# Altium schematic sheet 05_Ethernet_Interface.SchDoc
size A4; SheetNumber: 4; SheetTotal: 7
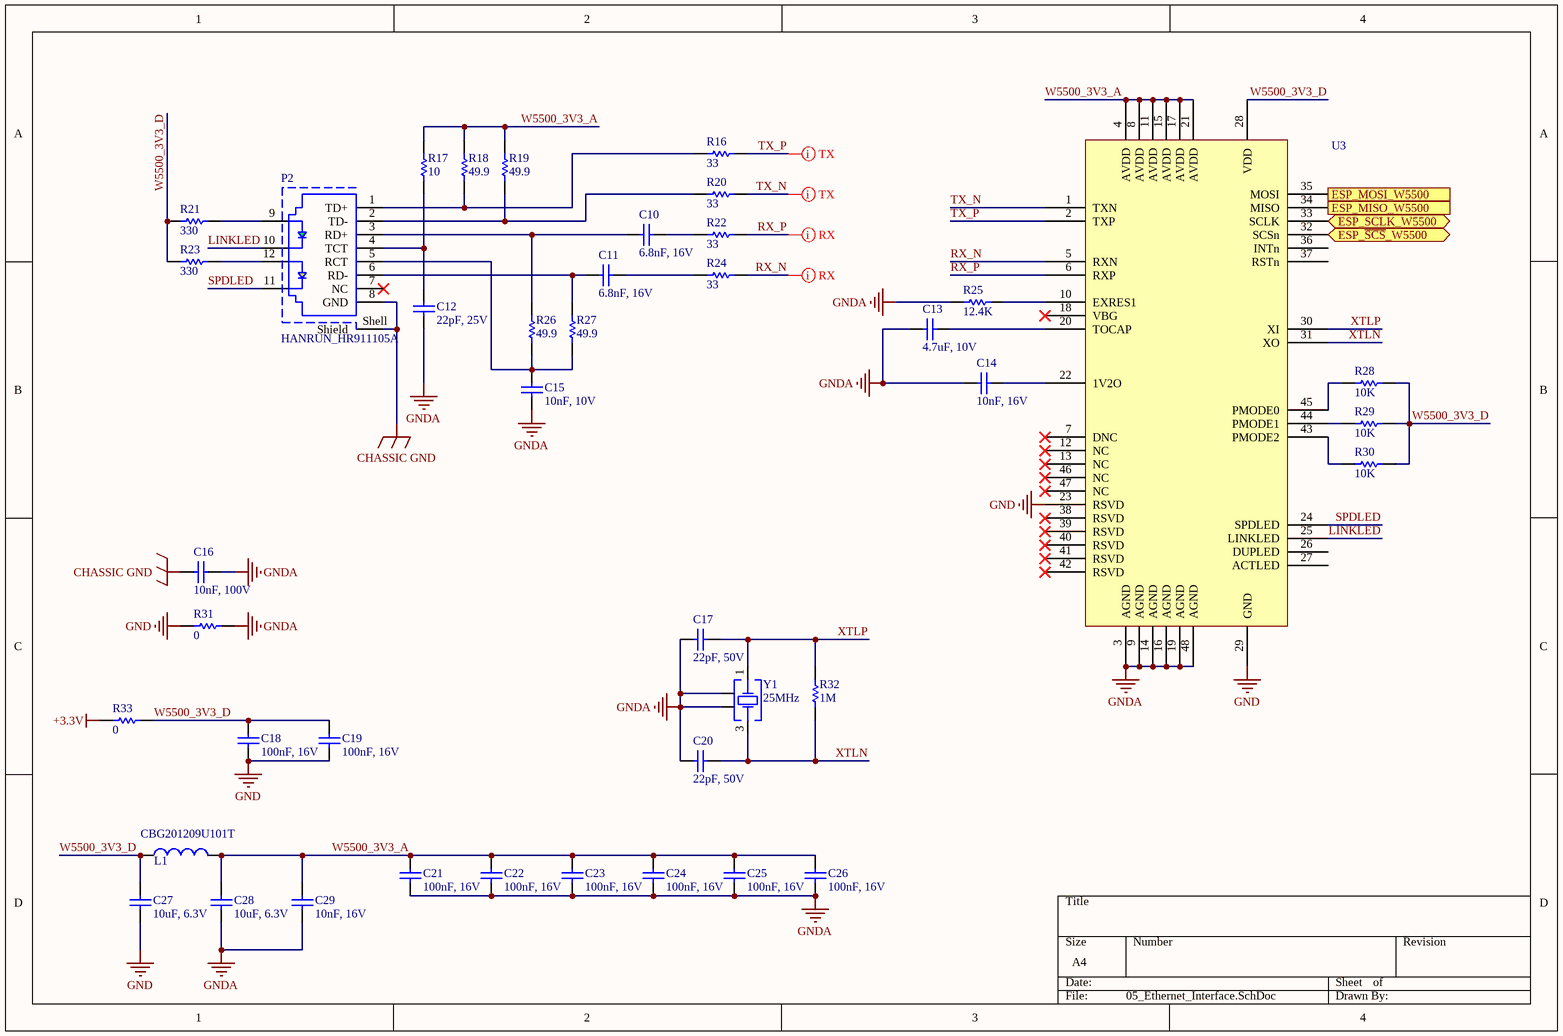
[diagram p0: 05_Ethernet_Interface.SchDoc]

## Parts
C10  6.8nF, 16V  [WCAP-CSGP_0603_H=0.8mm_Reflow]
C11  6.8nF, 16V  [WCAP-CSGP_0603_H=0.8mm_Reflow]
C12  22pF, 25V  [WCAP-CSGP_0603_H=0.8mm_Reflow]
C13  4.7uF, 10V  [WCAP-CSGP_0603_H=0.8mm_Reflow]
C14  10nF, 16V  [WCAP-CSGP_0603_H=0.8mm_Reflow]
C15  10nF, 10V  [WCAP-CSGP_0603_H=0.8mm_Reflow]
C16  10nF, 100V  [WCAP-CSGP_0603_H=0.8mm_Reflow]
C17  22pF, 50V  [WCAP-CSGP_0603_H=0.8mm_Reflow]
C18  100nF, 16V  [WCAP-CSGP_0603_H=0.8mm_Reflow]
C19  100nF, 16V  [WCAP-CSGP_0603_H=0.8mm_Reflow]
C20  22pF, 50V  [WCAP-CSGP_0603_H=0.8mm_Reflow]
C21  100nF, 16V  [WCAP-CSGP_0603_H=0.8mm_Reflow]
C22  100nF, 16V  [WCAP-CSGP_0603_H=0.8mm_Reflow]
C23  100nF, 16V  [WCAP-CSGP_0603_H=0.8mm_Reflow]
C24  100nF, 16V  [WCAP-CSGP_0603_H=0.8mm_Reflow]
C25  100nF, 16V  [WCAP-CSGP_0603_H=0.8mm_Reflow]
C26  100nF, 16V  [WCAP-CSGP_0603_H=0.8mm_Reflow]
C27  10uF, 6.3V  [WCAP-CSGP_0603_H=0.8mm_Reflow]
C28  10uF, 6.3V  [WCAP-CSGP_0603_H=0.8mm_Reflow]
C29  10nF, 16V  [WCAP-CSGP_0603_H=0.8mm_Reflow]
L1  CBG201209U101T  [I0805]
P2  HANRUN_HR911105A  [HANRUN_HR911105A]
R16  value 33  [R0603]  (hidden comment: Resistor)
R17  value 10  [R0603]  (hidden comment: Resistor)
R18  value 49.9  [R0603]  (hidden comment: Resistor)
R19  value 49.9  [R0603]  (hidden comment: Resistor)
R20  value 33  [R0603]  (hidden comment: Resistor)
R21  value 330  [R0603]  (hidden comment: Resistor)
R22  value 33  [R0603]  (hidden comment: Resistor)
R23  value 330  [R0603]  (hidden comment: Resistor)
R24  value 33  [R0603]  (hidden comment: Resistor)
R25  value 12.4K  [R0603]  (hidden comment: Resistor)
R26  value 49.9  [R0603]  (hidden comment: Resistor)
R27  value 49.9  [R0603]  (hidden comment: Resistor)
R28  value 10K  [R0603]  (hidden comment: Resistor)
R29  value 10K  [R0603]  (hidden comment: Resistor)
R30  value 10K  [R0603]  (hidden comment: Resistor)
R31  value 0  [R0603]  (hidden comment: Resistor)
R32  value 1M  [R0603]  (hidden comment: Resistor)
R33  value 0  [R0805]  (hidden comment: Resistor)
U3  W5500  [TSQFP50P900X900X160-48N]  (value not drawn)
Y1  25MHz  [WE-XTAL_CFPX-180]

## Ports
ESP_MISO_W5500 (out), ESP_MOSI_W5500 (in), ESP_SCLK_W5500 (bidir), ESP_~{SCS}_W5500 (bidir)

## Nets
+3.3V: R33.2
CHASSIC GND: C16.1 P2.8(GND) P2.Shell(Shield)
GND: C18.1 C19.1 C27.1 R31.2 U3.23(RSVD) U3.29(GND)
GNDA: C12.1 C13.1 C14.2 C15.1 C16.2 C17.1 C20.1 C21.1 C22.1 C23.1 C24.1 C25.1 C26.1 C28.1 C29.1 R25.2 R31.1 U3.3(AGND) U3.9(AGND) U3.14(AGND) U3.16(AGND) U3.19(AGND) U3.48(AGND) Y1.2(GND&Lid) Y1.4(GND&Lid)
ESP_MISO_W5500: U3.34(MISO) ; port ESP_MISO_W5500
ESP_MOSI_W5500: U3.35(MOSI) ; port ESP_MOSI_W5500
ESP_~{SCS}_W5500: U3.32(SCSn) ; port ESP_~{SCS}_W5500
ESP_SCLK_W5500: U3.33(SCLK) ; port ESP_SCLK_W5500
LINKLED: P2.10 U3.25(LINKLED)
RX_N: R24.1 U3.5(RXN)
RX_P: R22.1 U3.6(RXP)
SPDLED: P2.11 U3.24(SPDLED)
TX_N: R20.1 U3.1(TXN)
TX_P: R16.1 U3.2(TXP)
W5500_3V3_A: C21.2 C22.2 C23.2 C24.2 C25.2 C26.2 C28.2 C29.2 L1.2 R17.2 R18.2 R19.2 U3.4(AVDD) U3.8(AVDD) U3.11(AVDD) U3.15(AVDD) U3.17(AVDD) U3.21(AVDD)
W5500_3V3_D: C18.2 C19.2 C27.2 L1.1 R21.2 R23.2 R28.2 R29.2 R30.2 R33.1 U3.28(VDD)
XTLN: C20.2 R32.1 U3.31(XO) Y1.3(Crystal)
XTLP: C17.2 R32.2 U3.30(XI) Y1.1(Crystal)
NetC10_1: C10.1 P2.3(RD+) R26.1
NetC10_2: C10.2 R22.2
NetC11_1: C11.1 P2.6(RD-) R27.1
NetC11_2: C11.2 R24.2
NetC12_2: C12.2 P2.4(TCT) R17.1
NetC13_2: C13.2 U3.20(TOCAP)
NetC14_1: C14.1 U3.22(1V2O)
NetC15_2: C15.2 P2.5(RCT) R26.2 R27.2
NetP2_1: P2.1(TD+) R16.2 R18.1
NetP2_2: P2.2(TD-) R19.1 R20.2
NetP2_9: P2.9 R21.1
NetP2_12: P2.12 R23.1
NetR25_1: R25.1 U3.10(EXRES1)
NetR28_1: R28.1 U3.45(PMODE0)
NetR29_1: R29.1 U3.44(PMODE1)
NetR30_1: R30.1 U3.43(PMODE2)

Not connected (* = marked no-connect by the designer): P2 7(NC)*; U3 7(DNC)* 12(NC)* 13(NC)* 18(VBG)* 26(DUPLED) 27(ACTLED) 36(INTn) 37(RSTn) 38(RSVD)* 39(RSVD)* 40(RSVD)* 41(RSVD)* 42(RSVD)* 46(NC)* 47(NC)*

## Layout directives
differential pair: RX_N, RX_P, TX_N, TX_P

## Library data of the parts
C10 C11 = 885012206039: WCAP-CSGP Multilayer Ceramic Chip Capacitor, General Purpose, size 0603, X7R, 6.8nF, 16V; Manufacturer: Wurth Elektronik; Rated Voltage: 16VDC; Isolation Resistance: >=10GOhm; Capacitance Tolerance: +/-10%; Technical Reference: X7R0603682K016DFCT10000; ComponentLink1Description: Manufacturer; ComponentLink1URL: http://www.we-online.de; ComponentLink2Description: Datasheet; ComponentLink2URL: https://www.we-online.com/catalog/datasheet/885012206039.pdf; Operating Temperature: -55 to +125degC; Packaging: Tape and Reel; Manufacturer Part Number: 885012206039; Published Date: May 2020; Ceramic Type: X7R; Dissipation Factor: =<3.5%; Height: 0.8mm; Mounting Technology: SMT; Size: 0603; Capacitance: 6.8nF
C12 = 885012006034: WCAP-CSGP Multilayer Ceramic Chip Capacitor, General Purpose, size 0603, NP0, 22pF, 25V; Manufacturer: Wurth Elektronik; Rated Voltage: 25VDC; Isolation Resistance: >=10GOhm; Capacitance Tolerance: +/-5%; Dissipation Factor: Q>=400+20C; Technical Reference: NP00603220J025DFCT10000; ComponentLink1Description: Manufacturer; ComponentLink1URL: http://www.we-online.de; ComponentLink2Description: Datasheet; ComponentLink2URL: https://www.we-online.com/catalog/datasheet/885012006034.pdf; Operating Temperature: -55 to +125degC; Packaging: Tape and Reel; Manufacturer Part Number: 885012006034; Published Date: May 2020; Ceramic Type: NP0; Height: 0.8mm; Mounting Technology: SMT; Size: 0603; Capacitance: 22pF
C13 = 885012106012: WCAP-CSGP Multilayer Ceramic Chip Capacitor, General Purpose, size 0603, X5R, 4.7uF, 10V; Manufacturer: Wurth Elektronik; Rated Voltage: 10VDC; Isolation Resistance: >=0.02GOhm; Capacitance Tolerance: +/-20%; Technical Reference: X5R0603475M010DFCT10000; ComponentLink1Description: Manufacturer; ComponentLink1URL: http://www.we-online.de; ComponentLink2Description: Datasheet; ComponentLink2URL: https://www.we-online.com/catalog/datasheet/885012106012.pdf; Operating Temperature: -55 to +85degC; Packaging: Tape and Reel; Manufacturer Part Number: 885012106012; Published Date: May 2020; Ceramic Type: X5R; Dissipation Factor: =<10%; Height: 0.8mm; Mounting Technology: SMT; Size: 0603; Capacitance: 4.7uF
C14 C29 = 885012206040: WCAP-CSGP Multilayer Ceramic Chip Capacitor, General Purpose, size 0603, X7R, 10nF, 16V; Manufacturer: Wurth Elektronik; Rated Voltage: 16VDC; Isolation Resistance: >=10GOhm; Capacitance Tolerance: +/-10%; Technical Reference: X7R0603103K016DFCT10000; ComponentLink1Description: Manufacturer; ComponentLink1URL: http://www.we-online.de; ComponentLink2Description: Datasheet; ComponentLink2URL: https://www.we-online.com/catalog/datasheet/885012206040.pdf; Operating Temperature: -55 to +125degC; Packaging: Tape and Reel; Manufacturer Part Number: 885012206040; Published Date: May 2020; Ceramic Type: X7R; Dissipation Factor: =<3.5%; Height: 0.8mm; Mounting Technology: SMT; Size: 0603; Capacitance: 10nF
C15 = 885012206014: WCAP-CSGP Multilayer Ceramic Chip Capacitor, General Purpose, size 0603, X7R, 10nF, 10V; Manufacturer: Wurth Elektronik; Rated Voltage: 10VDC; Isolation Resistance: >=10GOhm; Capacitance Tolerance: +/-10%; Technical Reference: X7R0603103K010DFCT10000; ComponentLink1Description: Manufacturer; ComponentLink1URL: http://www.we-online.de; ComponentLink2Description: Datasheet; ComponentLink2URL: https://www.we-online.com/catalog/datasheet/885012206014.pdf; Operating Temperature: -55 to +125degC; Packaging: Tape and Reel; Manufacturer Part Number: 885012206014; Published Date: May 2020; Ceramic Type: X7R; Dissipation Factor: =<5%; Height: 0.8mm; Mounting Technology: SMT; Size: 0603; Capacitance: 10nF
C16 = 885012206114: WCAP-CSGP Multilayer Ceramic Chip Capacitor, General Purpose, size 0603, X7R, 10nF, 100V; Manufacturer: Wurth Elektronik; Rated Voltage: 100VDC; Isolation Resistance: >=10GOhm; Capacitance Tolerance: +/-10%; Technical Reference: X7R0603103K100DFCT10000; ComponentLink1Description: Manufacturer; ComponentLink1URL: http://www.we-online.de; ComponentLink2Description: Datasheet; ComponentLink2URL: https://www.we-online.com/catalog/datasheet/885012206114.pdf; Operating Temperature: -55 to +125degC; Packaging: Tape and Reel; Manufacturer Part Number: 885012206114; Published Date: May 2020; Ceramic Type: X7R; Dissipation Factor: =<2.5%; Height: 0.8mm; Mounting Technology: SMT; Size: 0603; Capacitance: 10nF
C17 C20 = 885012006053: WCAP-CSGP Multilayer Ceramic Chip Capacitor, General Purpose, size 0603, NP0, 22pF, 50V; Manufacturer: Wurth Elektronik; Rated Voltage: 50VDC; Isolation Resistance: >=10GOhm; Capacitance Tolerance: +/-5%; Dissipation Factor: Q>=400+20C; Technical Reference: NP00603220J050DFCT10000; ComponentLink1Description: Manufacturer; ComponentLink1URL: http://www.we-online.de; ComponentLink2Description: Datasheet; ComponentLink2URL: https://www.we-online.com/catalog/datasheet/885012006053.pdf; Operating Temperature: -55 to +125degC; Packaging: Tape and Reel; Manufacturer Part Number: 885012006053; Published Date: May 2020; Ceramic Type: NP0; Height: 0.8mm; Mounting Technology: SMT; Size: 0603; Capacitance: 22pF
C18 C19 C21-C26 = 885012206046: WCAP-CSGP Multilayer Ceramic Chip Capacitor, General Purpose, size 0603, X7R, 100nF, 16V; Manufacturer: Wurth Elektronik; Rated Voltage: 16VDC; Isolation Resistance: >=5GOhm; Capacitance Tolerance: +/-10%; Technical Reference: X7R0603104K016DFCT10000; ComponentLink1Description: Manufacturer; ComponentLink1URL: http://www.we-online.de; ComponentLink2Description: Datasheet; ComponentLink2URL: https://www.we-online.com/catalog/datasheet/885012206046.pdf; Operating Temperature: -55 to +125degC; Packaging: Tape and Reel; Manufacturer Part Number: 885012206046; Published Date: May 2020; Ceramic Type: X7R; Dissipation Factor: =<3.5%; Height: 0.8mm; Mounting Technology: SMT; Size: 0603; Capacitance: 100nF
C27 C28 = 885012106006: WCAP-CSGP Multilayer Ceramic Chip Capacitor, General Purpose, size 0603, X5R, 10uF, 6.3V; Manufacturer: Wurth Elektronik; Rated Voltage: 6.3VDC; Isolation Resistance: >=0.01GOhm; Capacitance Tolerance: +/-20%; Technical Reference: X5R0603106M6R3DFCT10000; ComponentLink1Description: Manufacturer; ComponentLink1URL: http://www.we-online.de; ComponentLink2Description: Datasheet; ComponentLink2URL: https://www.we-online.com/catalog/datasheet/885012106006.pdf; Operating Temperature: -55 to +85degC; Packaging: Tape and Reel; Manufacturer Part Number: 885012106006; Published Date: May 2020; Ceramic Type: X5R; Dissipation Factor: =<10%; Height: 0.8mm; Mounting Technology: SMT; Size: 0603; Capacitance: 10uF
L1 = CBG201209U101T: Impedance @ Frequency: 100 Ohm @ 100MHz; Current Rating (Max): 500mA; Value: 100 Ohm
Y1 = 830108340809: WE-XTAL Quartz Crystal, SMT, CFPX-180, 25MHz, +/-20ppm; Manufacturer: Wurth Elektronik; Frequency Stability: +/-30ppm; Load Capacitance: 12pF; ComponentLink1Description: Manufacturer; ComponentLink1URL: http://www.we-online.de; ComponentLink2Description: Datasheet; ComponentLink2URL: https://www.we-online.com/catalog/datasheet/830108340809.pdf; Operating Temperature: -40 to +105degC; Packaging: Tape and Reel; Manufacturer Part Number: 830108340809; Published Date: November 2020; Size: CFPX-180; Frequency: 25MHz; Frequency Tolerance: +/-20ppm; Mounting Technology: SMT